# EAGLE schematic en76-vco1 (EAGLE 6.6.0)
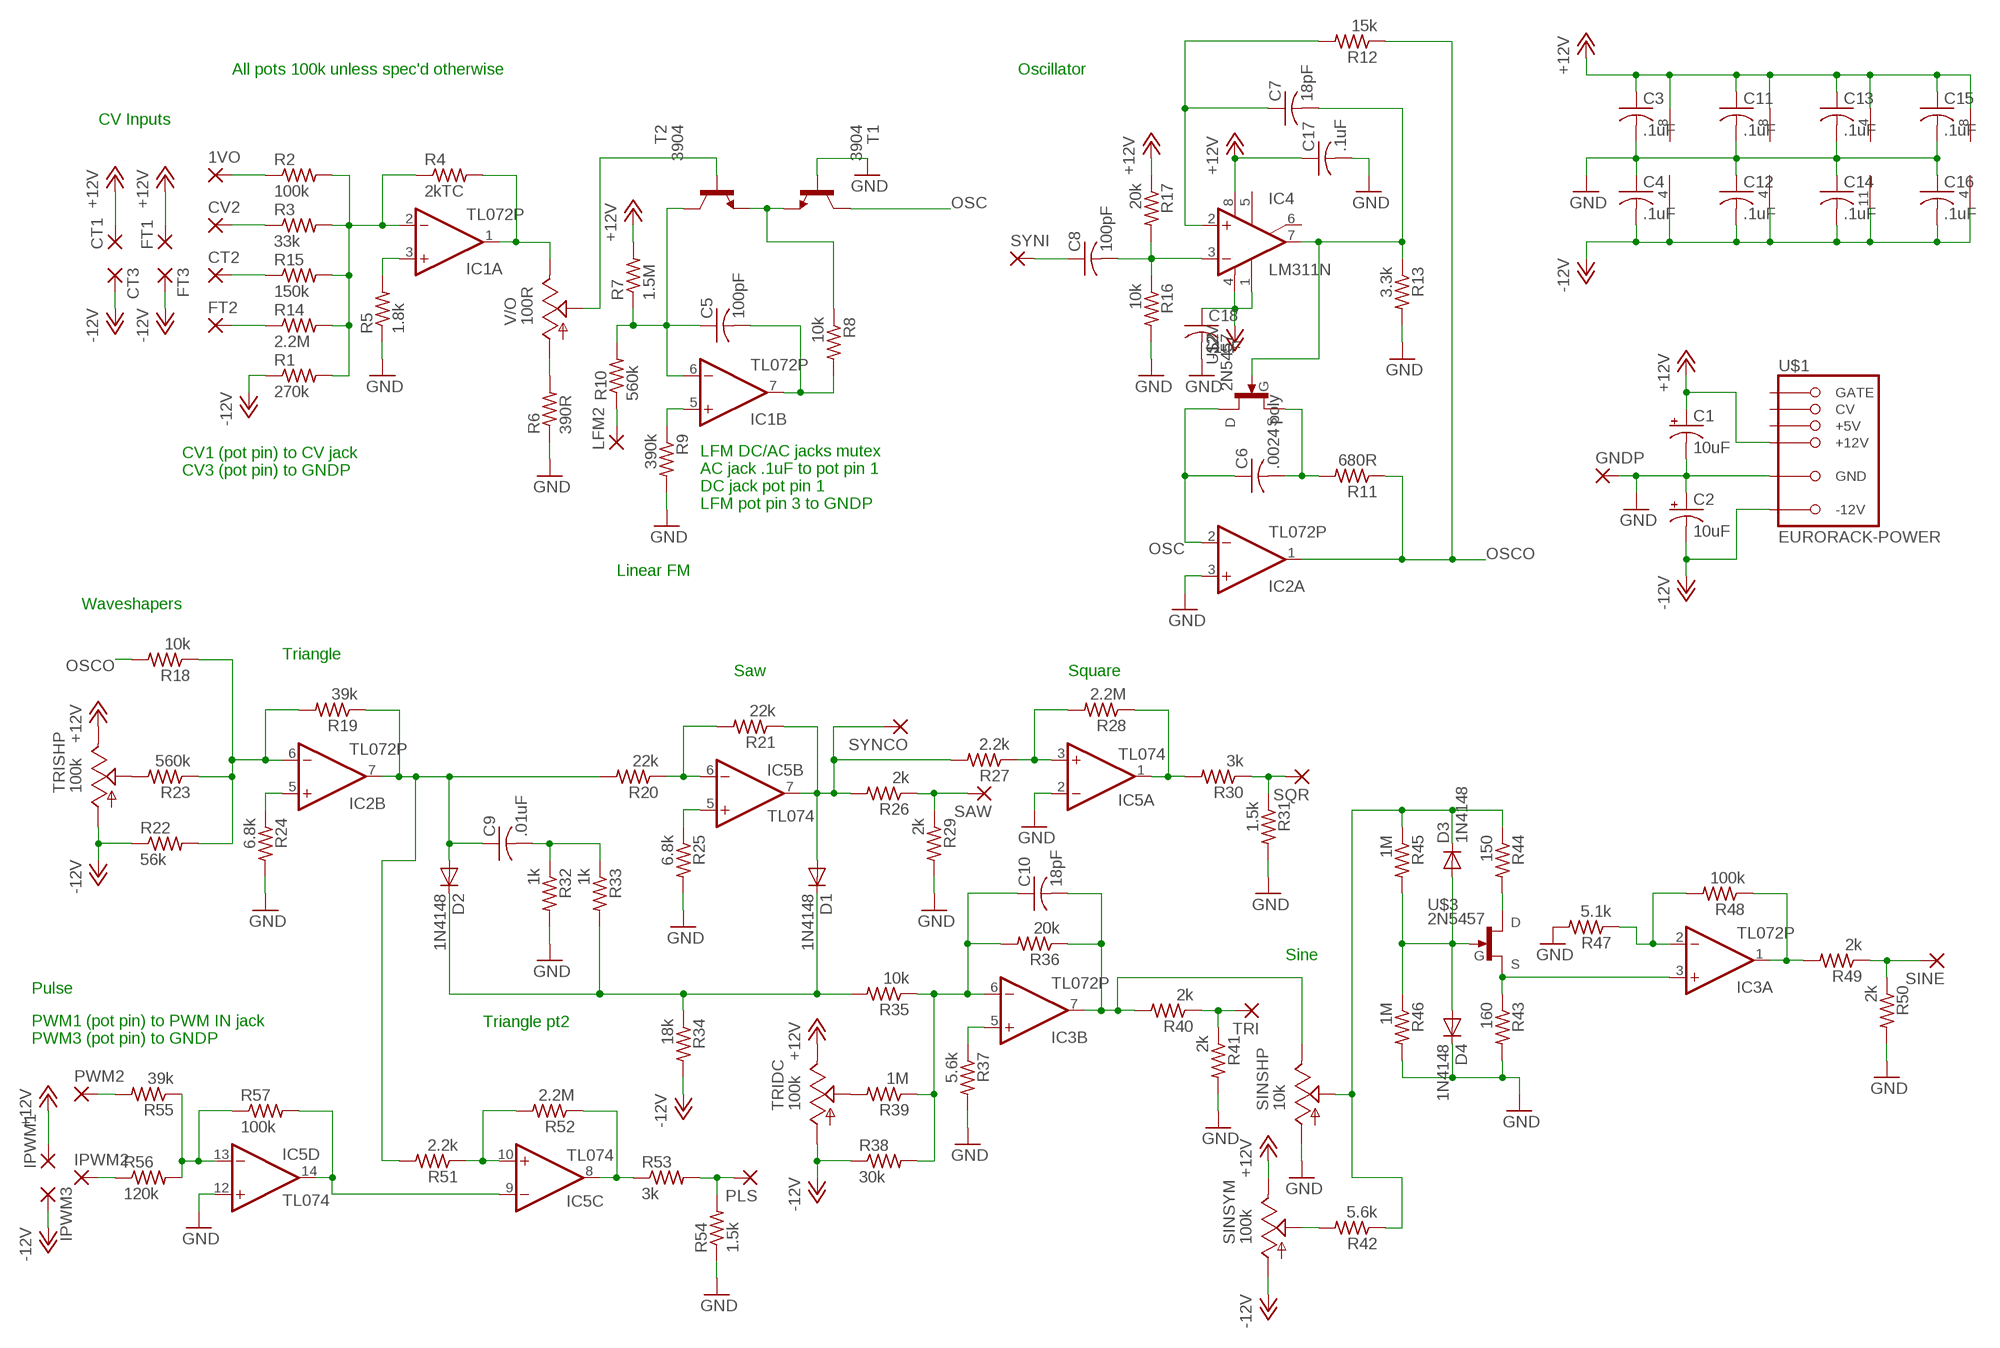
[diagram p0: schematic, sheet 1]

## Parts
1VO  2,54/1,0  [2,54/1,0]
C1  10uF  CPOL-USE2-5  [E2-5]
C2  10uF  CPOL-USE2-5  [E2-5]
C3  .1uF  C-US050-025X075  [C050-025X075]
C4  .1uF  C-US050-025X075  [C050-025X075]
C5  100pF  C-US050-025X075  [C050-025X075]
C6  .0024 poly  C-US050-025X075  [C050-025X075]
C7  18pF  C-US050-025X075  [C050-025X075]
C8  100pF  C-US050-025X075  [C050-025X075]
C9  .01uF  C-US050-025X075  [C050-025X075]
C10  18pF  C-US050-025X075  [C050-025X075]
C11  .1uF  C-US050-025X075  [C050-025X075]
C12  .1uF  C-US050-025X075  [C050-025X075]
C13  .1uF  C-US050-025X075  [C050-025X075]
C14  .1uF  C-US050-025X075  [C050-025X075]
C15  .1uF  C-US050-025X075  [C050-025X075]
C16  .1uF  C-US050-025X075  [C050-025X075]
C17  .1uF  C-US050-025X075  [C050-025X075]
C18  .1uF  C-US050-025X075  [C050-025X075]
CT1  2,54/1,0  [2,54/1,0]
CT2  2,54/1,0  [2,54/1,0]
CT3  2,54/1,0  [2,54/1,0]
CV2  2,54/1,0  [2,54/1,0]
D1  1N4148  1N4148DO35-7  [DO35-7]
D2  1N4148  1N4148DO35-7  [DO35-7]
D3  1N4148  1N4148DO35-7  [DO35-7]
D4  1N4148  1N4148DO35-7  [DO35-7]
FT1  2,54/1,0  [2,54/1,0]
FT2  2,54/1,0  [2,54/1,0]
FT3  2,54/1,0  [2,54/1,0]
GNDP  2,54/1,0  [2,54/1,0]
IC1  TL072P  [DIL08]
IC2  TL072P  [DIL08]
IC3  TL072P  [DIL08]
IC4  LM311N  [DIL08]
IC5  TL074  TL074-TOPP  [DIL14]
IPWM1  2,54/1,0  [2,54/1,0]
IPWM2  2,54/1,0  [2,54/1,0]
IPWM3  2,54/1,0  [2,54/1,0]
LFM2  2,54/1,0  [2,54/1,0]
PLS  2,54/1,0  [2,54/1,0]
PWM2  2,54/1,0  [2,54/1,0]
R1  270k  R-US_0207/10  [0207/10]
R2  100k  R-US_0207/10  [0207/10]
R3  33k  R-US_0207/10  [0207/10]
R4  2kTC  R-US_0207/10  [0207/10]
R5  1.8k  R-US_0207/10  [0207/10]
R6  390R  R-US_0207/10  [0207/10]
R7  1.5M  R-US_0207/10  [0207/10]
R8  10k  R-US_0207/10  [0207/10]
R9  390k  R-US_0207/10  [0207/10]
R10  560k  R-US_0207/10  [0207/10]
R11  680R  R-US_0207/10  [0207/10]
R12  15k  R-US_0207/10  [0207/10]
R13  3.3k  R-US_0207/10  [0207/10]
R14  2.2M  R-US_0207/10  [0207/10]
R15  150k  R-US_0207/10  [0207/10]
R16  10k  R-US_0207/10  [0207/10]
R17  20k  R-US_0207/10  [0207/10]
R18  10k  R-US_0207/10  [0207/10]
R19  39k  R-US_0207/10  [0207/10]
R20  22k  R-US_0207/10  [0207/10]
R21  22k  R-US_0207/10  [0207/10]
R22  56k  R-US_0207/10  [0207/10]
R23  560k  R-US_0207/10  [0207/10]
R24  6.8k  R-US_0207/10  [0207/10]
R25  6.8k  R-US_0207/10  [0207/10]
R26  2k  R-US_0207/10  [0207/10]
R27  2.2k  R-US_0207/10  [0207/10]
R28  2.2M  R-US_0207/10  [0207/10]
R29  2k  R-US_0207/10  [0207/10]
R30  3k  R-US_0207/10  [0207/10]
R31  1.5k  R-US_0207/10  [0207/10]
R32  1k  R-US_0207/10  [0207/10]
R33  1k  R-US_0207/10  [0207/10]
R34  18k  R-US_0207/10  [0207/10]
R35  10k  R-US_0207/10  [0207/10]
R36  20k  R-US_0207/10  [0207/10]
R37  5.6k  R-US_0207/10  [0207/10]
R38  30k  R-US_0207/10  [0207/10]
R39  1M  R-US_0207/10  [0207/10]
R40  2k  R-US_0207/10  [0207/10]
R41  2k  R-US_0207/10  [0207/10]
R42  5.6k  R-US_0207/10  [0207/10]
R43  160  R-US_0207/10  [0207/10]
R44  150  R-US_0207/10  [0207/10]
R45  1M  R-US_0207/10  [0207/10]
R46  1M  R-US_0207/10  [0207/10]
R47  5.1k  R-US_0207/10  [0207/10]
R48  100k  R-US_0207/10  [0207/10]
R49  2k  R-US_0207/10  [0207/10]
R50  2k  R-US_0207/10  [0207/10]
R51  2.2k  R-US_0207/10  [0207/10]
R52  2.2M  R-US_0207/10  [0207/10]
R53  3k  R-US_0207/10  [0207/10]
R54  1.5k  R-US_0207/10  [0207/10]
R55  39k  R-US_0207/10  [0207/10]
R56  120k  R-US_0207/10  [0207/10]
R57  100k  R-US_0207/10  [0207/10]
SAW  2,54/1,0  [2,54/1,0]
SINE  2,54/1,0  [2,54/1,0]
SINSHP  10k  TRIM_US-RJ9W  [RJ9W]
SINSYM  100k  TRIM_US-RJ9W  [RJ9W]
SQR  2,54/1,0  [2,54/1,0]
SYNCO  2,54/1,0  [2,54/1,0]
SYNI  2,54/1,0  [2,54/1,0]
T1  3904  2N3904-NPN-TO92-EBC  [TO92-EBC]
T2  3904  2N3904-NPN-TO92-EBC  [TO92-EBC]
TRI  2,54/1,0  [2,54/1,0]
TRIDC  100k  TRIM_US-RJ9W  [RJ9W]
TRISHP  100k  TRIM_US-RJ9W  [RJ9W]
U$1  EURORACK-POWER  [PINSHRD_PTH_2X8]
U$2  2N5457  [TO-92]
U$3  2N5457  [TO-92]
V/O  100R  TRIM_US-RJ9W  [RJ9W]

## Nets
+12V: C1.+ C3.1 C11.1 C13.1 C15.1 C17.1 CT1.1(P) FT1.1(P) IC1.8(P:V+) IC2.8(P:V+) IC3.8(P:V+) IC4.8(V+) IC5.4(P:V+) IPWM1.1(P) R7.2 R17.1 SINSYM.E TRIDC.E TRISHP.E U$1.+12V@1(+12V) U$1.+12V@2(+12V)
-12V: C2.- C4.2 C12.2 C14.2 C16.2 C18.1 CT3.1(P) FT3.1(P) IC1.4(P:V-) IC2.4(P:V-) IC3.4(P:V-) IC4.1(GND) IC4.4(V-) IC5.11(P:V-) IPWM3.1(P) R1.1 R22.1 R34.2 R38.1 SINSYM.A TRIDC.A TRISHP.A U$1.-12V@1(-12V) U$1.-12V@2(-12V)
GND: C1.- C2.+ C3.2 C4.1 C11.2 C12.1 C13.2 C14.1 C15.2 C16.1 C17.2 C18.2 D4.C GNDP.1(P) IC2.3(A:+IN) IC5.2(A:-IN) IC5.12(D:+IN) R5.1 R6.1 R9.2 R13.2 R16.2 R24.2 R25.2 R29.2 R31.2 R32.2 R37.2 R41.2 R43.2 R46.2 R47.2 R50.2 R54.1 SINSHP.A T1.B U$1.GND@1(GND) U$1.GND@2(GND) U$1.GND@3(GND) U$1.GND@4(GND) U$1.GND@5(GND) U$1.GND@6(GND)
N$1: CT2.1(P) R15.1
N$2: CV2.1(P) R3.1
N$3: 1VO.1(P) R2.1
N$4: T2.B V/O.S
N$5: IC1.3(A:+IN) R5.2
N$6: IC1.2(A:-IN) R1.2 R2.2 R3.2 R4.1 R14.2 R15.2
N$7: IC1.1(A:OUT) R4.2 V/O.E
N$8: R6.2 V/O.A
N$9: C5.1 IC1.6(B:-IN) R7.1 R10.2 T2.C
N$10: R8.1 T1.E T2.E
N$11: C5.2 IC1.7(B:OUT) R8.2
N$12: FT2.1(P) R14.1
N$13: LFM2.1(P) R10.1
N$14: IC1.5(B:+IN) R9.1
N$15: C7.1 IC4.2(+IN) R12.2
N$16: C7.2 IC4.7(OUT) R13.1 U$2.3(G)
N$17: R23.2 TRISHP.S
N$18: C6.2 R11.2 U$2.2(S)
N$19: D1.A IC5.7(B:OUT) R21.1 R26.2 R27.2 SYNCO.1(P)
N$20: C8.1 SYNI.1(P)
N$21: C8.2 IC4.3(-IN) R16.1 R17.2
N$22: PWM2.1(P) R55.2
N$23: IC2.5(B:+IN) R24.1
N$24: IC2.6(B:-IN) R18.1 R19.2 R22.2 R23.1
N$25: R26.1 R29.1 SAW.1(P)
N$26: IC5.6(B:-IN) R20.1 R21.2
N$27: C9.2 R32.1 R33.1
N$28: IC5.5(B:+IN) R25.1
N$29: IC5.3(A:+IN) R27.1 R28.2
N$30: IC5.1(A:OUT) R28.1 R30.2
N$31: R30.1 R31.1 SQR.1(P)
N$32: D1.C D2.C R33.2 R34.1 R35.2
N$33: R40.1 R41.1 TRI.1(P)
N$34: C10.2 IC3.7(B:OUT) R36.1 R40.2 SINSHP.E
N$35: IC3.5(B:+IN) R37.1
N$36: R39.2 TRIDC.S
N$37: C10.1 IC3.6(B:-IN) R35.1 R36.2 R38.2 R39.1
N$38: IC3.3(A:+IN) R43.1 U$3.2(S)
N$39: R44.2 U$3.1(D)
N$40: D3.A D4.A R45.2 R46.1 U$3.3(G)
N$41: R42.2 SINSYM.S
N$42: D3.C R42.1 R44.1 R45.1 SINSHP.S
N$43: IC3.2(A:-IN) R47.1 R48.2
N$44: R49.1 R50.1 SINE.1(P)
N$45: IC3.1(A:OUT) R48.1 R49.2
N$46: IC5.9(C:-IN) IC5.14(D:OUT) R57.2
N$47: IC5.10(C:+IN) R51.1 R52.2
N$48: IC5.8(C:OUT) R52.1 R53.1
N$49: PLS.1(P) R53.2 R54.2
N$50: C9.1 D2.A IC2.7(B:OUT) R19.1 R20.2 R51.2
N$51: IPWM2.1(P) R56.1
N$53: IC5.13(D:-IN) R55.1 R56.2 R57.1
OSC: C6.1 IC2.2(A:-IN) T1.C U$2.1(D)
OSCO: IC2.1(A:OUT) R11.1 R12.1 R18.2
Unconnected: IC4.5(ON) IC4.6(ON/STR) U$1.+5V@1(+5V) U$1.+5V@2(+5V) U$1.CV@1(CV) U$1.CV@2(CV) U$1.GATE@1(GATE) U$1.GATE@2(GATE)

## Notes on the sheet
- All pots 100k unless spec'd otherwise | Oscillator
- CV Inputs
- CV1 (pot pin) to CV jack
  CV3 (pot pin) to GNDP
- LFM DC/AC jacks mutex
  AC jack .1uF to pot pin 1
  DC jack pot pin 1
  LFM pot pin 3 to GNDP
- Linear FM
- Waveshapers
- Triangle
- Saw | Square
- Sine
- Pulse
- Triangle pt2
- PWM1 (pot pin) to PWM IN jack
  PWM3 (pot pin) to GNDP

## Library data of the parts
1VO CT1-CT3 CV2 FT1-FT3 GNDP IPWM1-IPWM3 LFM2 PLS PWM2 SAW SINE SQR SYNCO SYNI TRI = wirepad:2,54/1,0: THROUGH-HOLE PAD
C1 C2 = rcl:CPOL-US: POLARIZED CAPACITOR, American symbol
C3-C18 = rcl:C-US: CAPACITOR, American symbol
D1-D4 = diode:1N4148: DIODE high speed (Philips)
IC1-IC3 = mmoretti:TL072: OP AMP
IC4 = linear:LM311: COMPARATOR
IC5 = mmoretti:TL074-TOP: OP AMP
R1-R57 = rcl:R-US_: RESISTOR, American symbol
SINSHP SINSYM TRIDC TRISHP V/O = pot:TRIM_US-: POTENTIOMETER
T1 T2 = transistor-neu-to92:*-NPN-: NPN Transistror
U$1 = mmoretti:EURORACK-POWER
U$2 U$3 = transistors-random:2N54*: 2N54xx N-channel JFET